# Altium schematic sheet BEEP.SchDoc
size A4
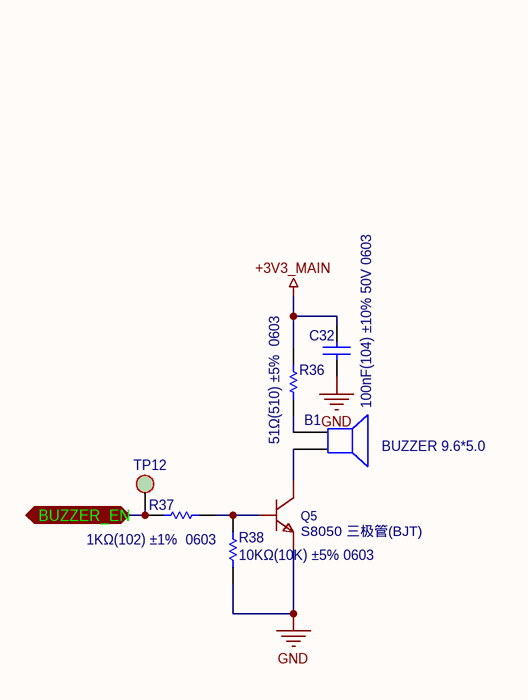
[diagram p0: BEEP.SchDoc]

## Parts
B1  BUZZER 9.6*5.0  [BUZZER 9.6×H5.0mm]
C32  100nF(104) ±10% 50V 0603  [C0603]
Q5  S8050 三极管(BJT)  [SOT233]
R36  51Ω(510) ±5%  0603  [R0603]
R37  1KΩ(102) ±1%  0603  [R0603]
R38  10KΩ(10K) ±5% 0603  [R0603]
TP12  NC  [TP]  (value not drawn)

## Ports
BUZZER_EN

## Nets
+3V3_MAIN: C32.1 R36.2
GND: C32.2 Q5.2(E) R38.2
BUZZER_EN: R37.2 TP12.1 ; port BUZZER_EN
NetB1_1: B1.1 R36.1
NetB1_2: B1.2 Q5.3(C)
NetQ5_1: Q5.1(B) R37.1 R38.1

## Library data of the parts
B1 = Speaker: 直插蜂鸣器 9.6*5.0; Published: 24-Mar-1999; LatestRevisionDate: 17-Jul-2002; LatestRevisionNote: Re-released for DXP Platform.; PackageReference: PIN2; Publisher: Altium Limited
C32 = Cap: 0603贴片电容; Published: 8-Jun-2000; LatestRevisionDate: 17-Jul-2002; LatestRevisionNote: Re-released for DXP Platform.; PackageReference: RAD-0.3; Publisher: Altium Limited; PackageDescription: Radial Cap, Thru-Hole; 2 Leads; 0.3 in Pin Spacing
Q5 = S8050_C908252: NPN 三极管(BJT); BOM_Manufacturer: FUXINSEMI; Contributor: LCSC; BOM_Supplier: LCSC; BOM_Supplier Part: C908252; BOM_Manufacturer Part: S8050; BOM_JLCPCB Part Class: Extended Part; spicePre: Q; spiceSymbolName: S8050_C908252
R36-R38 = Res1: 0603贴片电阻; Published: 8-Jun-2000; LatestRevisionDate: 17-Jul-2002; LatestRevisionNote: Re-released for DXP Platform.; PackageReference: AXIAL-0.3; Publisher: Altium Limited; PackageDescription: Axial Device, Thru-Hole; 2 Leads; 0.3 in Pin Spacing
TP12 = TP: 测试点